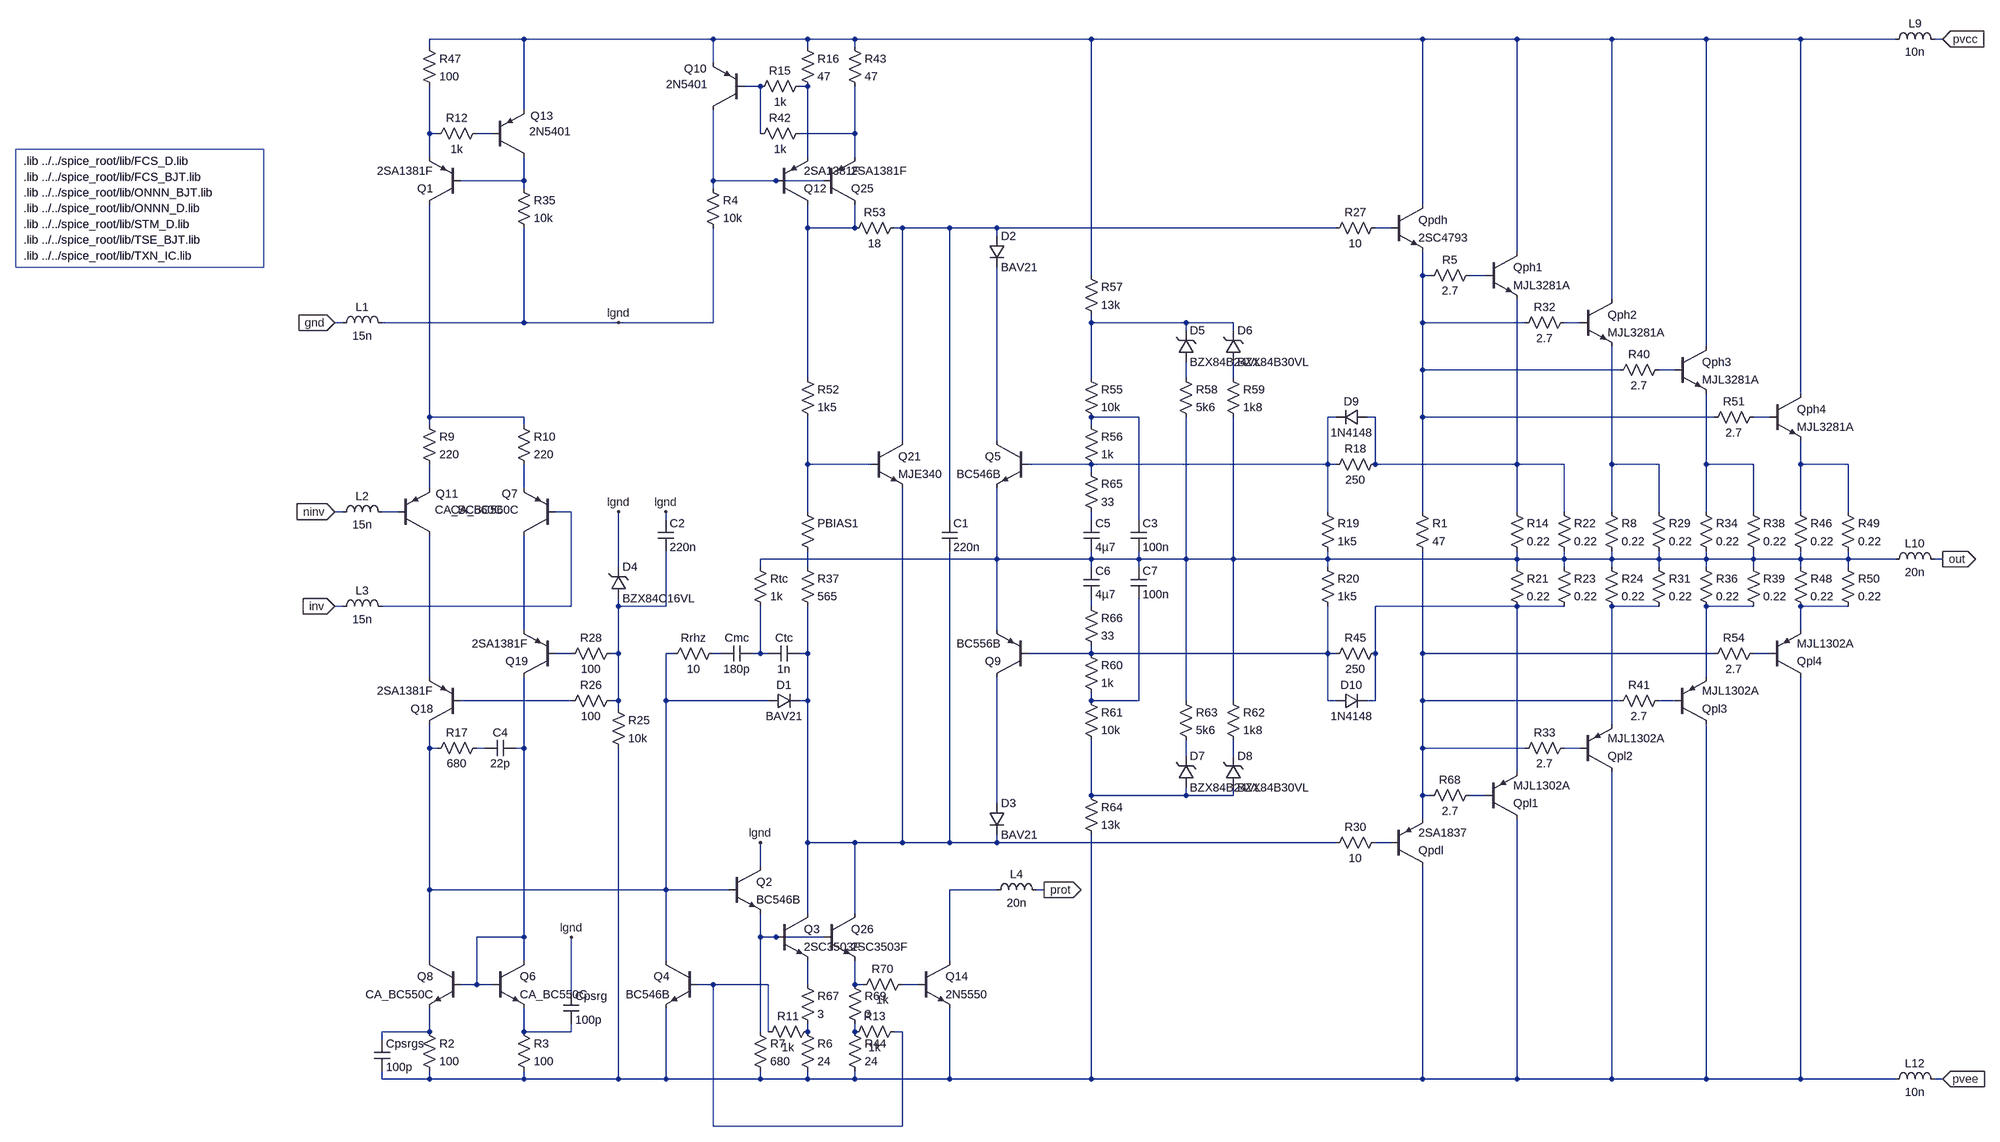
[diagram p0: schematic pab3bbb-arguo-module.asc]
pab3bbb-arguo-module.asc, the LTspice schematic file:
Version 4
SHEET 1 6124 2336
WIRE -192 -1280 -384 -1280
WIRE 192 -1280 -192 -1280
WIRE 384 -1280 192 -1280
WIRE 480 -1280 384 -1280
WIRE 960 -1280 480 -1280
WIRE 1632 -1280 960 -1280
WIRE 1824 -1280 1632 -1280
WIRE 2016 -1280 1824 -1280
WIRE 2208 -1280 2016 -1280
WIRE 2400 -1280 2208 -1280
WIRE 2592 -1280 2400 -1280
WIRE 2688 -1280 2672 -1280
WIRE -384 -1264 -384 -1280
WIRE 384 -1264 384 -1280
WIRE 480 -1264 480 -1280
WIRE 192 -1232 192 -1280
WIRE 288 -1184 256 -1184
WIRE 384 -1184 368 -1184
WIRE -192 -1136 -192 -1280
WIRE -384 -1088 -384 -1184
WIRE -368 -1088 -384 -1088
WIRE -256 -1088 -288 -1088
WIRE 288 -1088 288 -1184
WIRE 480 -1088 480 -1184
WIRE 480 -1088 368 -1088
WIRE -384 -1040 -384 -1088
WIRE 384 -1040 384 -1184
WIRE 480 -1040 480 -1088
WIRE -192 -992 -192 -1040
WIRE -192 -992 -320 -992
WIRE 192 -992 192 -1136
WIRE 320 -992 192 -992
WIRE 416 -992 320 -992
WIRE -192 -976 -192 -992
WIRE 192 -976 192 -992
WIRE 1632 -944 1632 -1280
WIRE 384 -896 384 -944
WIRE 480 -896 480 -944
WIRE 480 -896 384 -896
WIRE 576 -896 560 -896
WIRE 672 -896 576 -896
WIRE 768 -896 672 -896
WIRE 1456 -896 768 -896
WIRE 1568 -896 1536 -896
WIRE 768 -880 768 -896
WIRE 1824 -848 1824 -1280
WIRE 960 -800 960 -1280
WIRE 1632 -800 1632 -848
WIRE 1648 -800 1632 -800
WIRE 1760 -800 1728 -800
WIRE 2016 -752 2016 -1280
WIRE -560 -704 -576 -704
WIRE -192 -704 -192 -896
WIRE -192 -704 -480 -704
WIRE 0 -704 -192 -704
WIRE 192 -704 192 -896
WIRE 192 -704 0 -704
WIRE 960 -704 960 -720
WIRE 1152 -704 960 -704
WIRE 1248 -704 1152 -704
WIRE 1632 -704 1632 -800
WIRE 1840 -704 1632 -704
WIRE 1952 -704 1920 -704
WIRE 1152 -688 1152 -704
WIRE 1248 -688 1248 -704
WIRE 2208 -656 2208 -1280
WIRE 1632 -608 1632 -704
WIRE 2032 -608 1632 -608
WIRE 2144 -608 2112 -608
WIRE 384 -592 384 -896
WIRE 960 -592 960 -704
WIRE 1152 -592 1152 -624
WIRE 1248 -592 1248 -624
WIRE 2400 -560 2400 -1280
WIRE -384 -512 -384 -944
WIRE -192 -512 -384 -512
WIRE 1056 -512 960 -512
WIRE 1456 -512 1440 -512
WIRE 1536 -512 1520 -512
WIRE 1632 -512 1632 -608
WIRE 2224 -512 1632 -512
WIRE 2336 -512 2304 -512
WIRE -384 -496 -384 -512
WIRE -192 -496 -192 -512
WIRE 960 -496 960 -512
WIRE 576 -464 576 -896
WIRE 768 -464 768 -816
WIRE 384 -416 384 -512
WIRE 512 -416 384 -416
WIRE 960 -416 832 -416
WIRE 1440 -416 1440 -512
WIRE 1440 -416 960 -416
WIRE 1456 -416 1440 -416
WIRE 1536 -416 1536 -512
WIRE 1824 -416 1824 -752
WIRE 1824 -416 1536 -416
WIRE 1920 -416 1824 -416
WIRE 2016 -416 2016 -656
WIRE 2112 -416 2016 -416
WIRE 2208 -416 2208 -560
WIRE 2304 -416 2208 -416
WIRE 2400 -416 2400 -464
WIRE 2496 -416 2400 -416
WIRE 960 -400 960 -416
WIRE -384 -368 -384 -416
WIRE -192 -368 -192 -416
WIRE -560 -320 -576 -320
WIRE -448 -320 -480 -320
WIRE -96 -320 -128 -320
WIRE 384 -320 384 -416
WIRE 1440 -320 1440 -416
WIRE 1632 -320 1632 -512
WIRE 1824 -320 1824 -416
WIRE 1920 -320 1920 -416
WIRE 2016 -320 2016 -416
WIRE 2112 -320 2112 -416
WIRE 2208 -320 2208 -416
WIRE 2304 -320 2304 -416
WIRE 2400 -320 2400 -416
WIRE 2496 -320 2496 -416
WIRE 96 -304 96 -320
WIRE 672 -304 672 -896
WIRE 960 -304 960 -320
WIRE 1056 -304 1056 -512
WIRE 768 -224 768 -368
WIRE 768 -224 288 -224
WIRE 960 -224 960 -240
WIRE 960 -224 768 -224
WIRE 1056 -224 1056 -240
WIRE 1056 -224 960 -224
WIRE 1152 -224 1152 -512
WIRE 1152 -224 1056 -224
WIRE 1248 -224 1248 -512
WIRE 1248 -224 1152 -224
WIRE 1440 -224 1440 -240
WIRE 1440 -224 1248 -224
WIRE 1824 -224 1824 -240
WIRE 1824 -224 1440 -224
WIRE 1920 -224 1920 -240
WIRE 1920 -224 1824 -224
WIRE 2016 -224 2016 -240
WIRE 2016 -224 1920 -224
WIRE 2112 -224 2112 -240
WIRE 2112 -224 2016 -224
WIRE 2208 -224 2208 -240
WIRE 2208 -224 2112 -224
WIRE 2304 -224 2304 -240
WIRE 2304 -224 2208 -224
WIRE 2400 -224 2400 -240
WIRE 2400 -224 2304 -224
WIRE 2496 -224 2496 -240
WIRE 2496 -224 2400 -224
WIRE 2592 -224 2496 -224
WIRE 2688 -224 2672 -224
WIRE 0 -208 0 -320
WIRE 288 -208 288 -224
WIRE 384 -208 384 -240
WIRE 960 -208 960 -224
WIRE 1056 -208 1056 -224
WIRE 1440 -208 1440 -224
WIRE 1824 -208 1824 -224
WIRE 1920 -208 1920 -224
WIRE 2016 -208 2016 -224
WIRE 2112 -208 2112 -224
WIRE 2208 -208 2208 -224
WIRE 2304 -208 2304 -224
WIRE 2400 -208 2400 -224
WIRE 2496 -208 2496 -224
WIRE -560 -128 -576 -128
WIRE -96 -128 -96 -320
WIRE -96 -128 -480 -128
WIRE 0 -128 0 -144
WIRE 96 -128 96 -240
WIRE 96 -128 0 -128
WIRE 960 -128 960 -144
WIRE 1824 -128 1536 -128
WIRE 1920 -128 1824 -128
WIRE 2112 -128 2016 -128
WIRE 2304 -128 2208 -128
WIRE 2496 -128 2400 -128
WIRE -192 -80 -192 -272
WIRE 768 -80 768 -224
WIRE 2400 -80 2400 -128
WIRE -96 -32 -128 -32
WIRE 0 -32 0 -128
WIRE 0 -32 -16 -32
WIRE 112 -32 96 -32
WIRE 208 -32 192 -32
WIRE 288 -32 288 -128
WIRE 288 -32 272 -32
WIRE 304 -32 288 -32
WIRE 384 -32 384 -128
WIRE 384 -32 368 -32
WIRE 960 -32 960 -48
WIRE 960 -32 832 -32
WIRE 1440 -32 1440 -128
WIRE 1440 -32 960 -32
WIRE 1456 -32 1440 -32
WIRE 1536 -32 1536 -128
WIRE 1632 -32 1632 -240
WIRE 2224 -32 1632 -32
WIRE 2336 -32 2304 -32
WIRE -384 16 -384 -272
WIRE 2208 16 2208 -128
WIRE -96 64 -320 64
WIRE 0 64 0 -32
WIRE 0 64 -16 64
WIRE 96 64 96 -32
WIRE 304 64 96 64
WIRE 384 64 384 -32
WIRE 384 64 368 64
WIRE 960 64 960 48
WIRE 1056 64 1056 -144
WIRE 1056 64 960 64
WIRE 1152 64 1152 -224
WIRE 1248 64 1248 -224
WIRE 1440 64 1440 -32
WIRE 1456 64 1440 64
WIRE 1536 64 1536 -32
WIRE 1536 64 1520 64
WIRE 1632 64 1632 -32
WIRE 2032 64 1632 64
WIRE 2144 64 2112 64
WIRE 0 80 0 64
WIRE 2016 112 2016 -128
WIRE -384 160 -384 112
WIRE -368 160 -384 160
WIRE -272 160 -288 160
WIRE -192 160 -192 16
WIRE -192 160 -208 160
WIRE 1632 160 1632 64
WIRE 1840 160 1632 160
WIRE 1952 160 1920 160
WIRE 1152 176 1152 144
WIRE 1248 176 1248 144
WIRE 1824 208 1824 -128
WIRE 960 256 960 144
WIRE 1152 256 1152 240
WIRE 1152 256 960 256
WIRE 1248 256 1248 240
WIRE 1248 256 1152 256
WIRE 1632 256 1632 160
WIRE 1648 256 1632 256
WIRE 1760 256 1728 256
WIRE 768 272 768 16
WIRE 1632 304 1632 256
WIRE 384 352 384 64
WIRE 480 352 384 352
WIRE 576 352 576 -368
WIRE 576 352 480 352
WIRE 672 352 672 -240
WIRE 672 352 576 352
WIRE 768 352 768 336
WIRE 768 352 672 352
WIRE 1456 352 768 352
WIRE 1568 352 1536 352
WIRE 288 400 288 352
WIRE -384 448 -384 160
WIRE 96 448 96 64
WIRE 96 448 -384 448
WIRE 224 448 96 448
WIRE 768 448 672 448
WIRE 864 448 848 448
WIRE 384 496 384 352
WIRE 480 496 480 352
WIRE -192 544 -192 160
WIRE -192 544 -288 544
WIRE 288 544 288 496
WIRE 320 544 288 544
WIRE 416 544 320 544
WIRE -384 592 -384 448
WIRE -192 592 -192 544
WIRE 96 592 96 448
WIRE 672 592 672 448
WIRE -288 640 -288 544
WIRE -288 640 -320 640
WIRE -256 640 -288 640
WIRE 192 640 160 640
WIRE 304 640 192 640
WIRE 384 640 384 592
WIRE 480 640 480 592
WIRE 496 640 480 640
WIRE 608 640 576 640
WIRE -96 656 -96 544
WIRE -384 736 -384 688
WIRE -384 736 -480 736
WIRE -192 736 -192 688
WIRE -96 736 -96 720
WIRE -96 736 -192 736
WIRE 288 736 288 544
WIRE 304 736 304 640
WIRE 384 736 384 720
WIRE 480 736 480 720
WIRE 576 736 560 736
WIRE -480 752 -480 736
WIRE -480 832 -480 816
WIRE -384 832 -384 816
WIRE -384 832 -480 832
WIRE -192 832 -192 816
WIRE -192 832 -384 832
WIRE 0 832 0 160
WIRE 0 832 -192 832
WIRE 96 832 96 688
WIRE 96 832 0 832
WIRE 288 832 288 816
WIRE 288 832 96 832
WIRE 384 832 384 816
WIRE 384 832 288 832
WIRE 480 832 480 816
WIRE 480 832 384 832
WIRE 672 832 672 688
WIRE 672 832 480 832
WIRE 960 832 960 336
WIRE 960 832 672 832
WIRE 1632 832 1632 400
WIRE 1632 832 960 832
WIRE 1824 832 1824 304
WIRE 1824 832 1632 832
WIRE 2016 832 2016 208
WIRE 2016 832 1824 832
WIRE 2208 832 2208 112
WIRE 2208 832 2016 832
WIRE 2400 832 2400 16
WIRE 2400 832 2208 832
WIRE 2592 832 2400 832
WIRE 2688 832 2672 832
WIRE 192 928 192 640
WIRE 576 928 576 736
WIRE 576 928 192 928
FLAG 2688 -1280 pvcc
IOPIN 2688 -1280 In
FLAG 2688 832 pvee
IOPIN 2688 832 In
FLAG 2688 -224 out
IOPIN 2688 -224 Out
FLAG -576 -320 ninv
IOPIN -576 -320 In
FLAG -576 -128 inv
IOPIN -576 -128 In
FLAG -576 -704 gnd
IOPIN -576 -704 In
FLAG 0 -704 lgnd
FLAG 0 -320 lgnd
FLAG 96 -320 lgnd
FLAG 288 352 lgnd
FLAG -96 544 lgnd
FLAG 864 448 prot
IOPIN 864 448 Out
SYMBOL pnp -448 -272 M180
WINDOW 0 77 84 Left 2
WINDOW 3 75 52 Left 2
SYMATTR InstName Q11
SYMATTR Value CA_BC560C
SYMBOL res -400 720 R0
SYMATTR InstName R2
SYMATTR Value 100
SYMBOL res -208 720 R0
SYMATTR InstName R3
SYMATTR Value 100
SYMBOL res -400 -512 R0
SYMATTR InstName R9
SYMATTR Value 220
SYMBOL res -208 -512 R0
SYMATTR InstName R10
SYMATTR Value 220
SYMBOL res 368 -1280 R0
SYMATTR InstName R16
SYMATTR Value 47
SYMBOL pnp 320 -944 M180
SYMATTR InstName Q12
SYMATTR Value 2SA1381F
SYMBOL res 1552 -912 R90
WINDOW 0 0 56 VBottom 2
WINDOW 3 32 56 VTop 2
SYMATTR InstName R27
SYMATTR Value 10
SYMBOL res 1552 336 R90
WINDOW 0 0 56 VBottom 2
WINDOW 3 32 56 VTop 2
SYMATTR InstName R30
SYMATTR Value 10
SYMBOL res -400 -1280 R0
SYMATTR InstName R47
SYMATTR Value 100
SYMBOL res 368 -336 R0
WINDOW 3 36 76 Invisible 2
SYMATTR Value {1+(500*BIAS)}
SYMATTR InstName PBIAS1
SYMBOL res 368 -608 R0
SYMATTR InstName R52
SYMATTR Value 1k5
SYMBOL res 576 -912 R90
WINDOW 0 0 56 VBottom 2
WINDOW 3 32 56 VTop 2
SYMATTR InstName R53
SYMATTR Value 18
SYMBOL npn 320 496 R0
SYMATTR InstName Q3
SYMATTR Value 2SC3503F
SYMBOL res 368 720 R0
SYMATTR InstName R6
SYMATTR Value 24
SYMBOL res 176 -992 R0
SYMATTR InstName R4
SYMATTR Value 10k
SYMBOL pnp -320 -944 R180
SYMATTR InstName Q1
SYMATTR Value 2SA1381F
SYMBOL pnp -128 -272 R180
WINDOW 0 77 84 Left 2
WINDOW 3 75 52 Left 2
SYMATTR InstName Q7
SYMATTR Value CA_BC560C
SYMBOL npn 512 -464 R0
SYMATTR InstName Q21
SYMATTR Value MJE340
SYMBOL res 368 -224 R0
SYMATTR InstName R37
SYMATTR Value 565
SYMBOL npn 1760 -848 R0
SYMATTR InstName Qph1
SYMATTR Value MJL3281A
SYMBOL pnp 1760 304 M180
SYMATTR InstName Qpl1
SYMATTR Value MJL1302A
SYMBOL res 1744 -816 R90
WINDOW 0 0 56 VBottom 2
WINDOW 3 32 56 VTop 2
SYMATTR InstName R5
SYMATTR Value 2.7
SYMBOL res 1744 240 R90
WINDOW 0 0 56 VBottom 2
WINDOW 3 32 56 VTop 2
SYMATTR InstName R68
SYMATTR Value 2.7
SYMBOL cap 272 -48 R90
WINDOW 0 0 32 VBottom 2
WINDOW 3 32 32 VTop 2
SYMATTR InstName Cmc
SYMATTR Value 180p
SYMATTR SpiceLine V=100 Irms=20.8m Rser=5.448 Lser=3n Rpar=6.4meg Cpar=1p
SYMBOL npn -256 592 R0
SYMATTR InstName Q6
SYMATTR Value CA_BC550C
SYMBOL npn -320 592 M0
SYMATTR InstName Q8
SYMATTR Value CA_BC550C
SYMBOL res 384 -1200 R90
WINDOW 0 0 56 VBottom 2
WINDOW 3 32 56 VTop 2
SYMATTR InstName R15
SYMATTR Value 1k
SYMBOL npn 224 400 R0
SYMATTR InstName Q2
SYMATTR Value BC546B
SYMBOL res 272 720 R0
SYMATTR InstName R7
SYMATTR Value 680
SYMBOL cap 368 -48 R90
WINDOW 0 0 32 VBottom 2
WINDOW 3 32 32 VTop 2
SYMATTR InstName Ctc
SYMATTR Value 1n
SYMATTR SpiceLine V=100 Irms=75.3m Rser=2.89088 Lser=3n Rpar=4.4meg Cpar=1p
SYMBOL res 272 -224 R0
SYMATTR InstName Rtc
SYMATTR Value 1k
SYMBOL diode 304 80 R270
WINDOW 0 32 32 VTop 2
WINDOW 3 0 32 VBottom 2
SYMATTR InstName D1
SYMATTR Value BAV21
SYMBOL pnp 256 -1136 R180
WINDOW 0 77 84 Left 2
WINDOW 3 75 52 Left 2
SYMATTR InstName Q10
SYMATTR Value 2N5401
SYMBOL res 1808 -336 R0
SYMATTR InstName R14
SYMATTR Value 0.22
SYMBOL res 1808 -224 R0
SYMATTR InstName R21
SYMATTR Value 0.22
SYMBOL res -208 -992 R0
SYMATTR InstName R35
SYMATTR Value 10k
SYMBOL cap 656 -240 M180
WINDOW 0 24 56 Left 2
WINDOW 3 24 8 Left 2
SYMATTR InstName C1
SYMATTR Value 220n
SYMATTR SpiceLine V=25 Irms=1.76 Rser=0.057522 Lser=3n Rpar=4.4meg Cpar=1p
SYMBOL ind -576 -688 R270
WINDOW 0 32 56 VTop 2
WINDOW 3 5 56 VBottom 2
SYMATTR InstName L1
SYMATTR Value 15n
SYMATTR SpiceLine Rser=20m
SYMBOL ind -576 -304 R270
WINDOW 0 32 56 VTop 2
WINDOW 3 5 56 VBottom 2
SYMATTR InstName L2
SYMATTR Value 15n
SYMATTR SpiceLine Rser=20m
SYMBOL ind -576 -112 R270
WINDOW 0 32 56 VTop 2
WINDOW 3 5 56 VBottom 2
SYMATTR InstName L3
SYMATTR Value 15n
SYMATTR SpiceLine Rser=20m
SYMBOL ind 2576 -208 R270
WINDOW 0 32 56 VTop 2
WINDOW 3 5 56 VBottom 2
SYMATTR InstName L10
SYMATTR Value 20n
SYMATTR SpiceLine Rser=10m
SYMBOL ind 2576 -1264 R270
WINDOW 0 32 56 VTop 2
WINDOW 3 5 56 VBottom 2
SYMATTR InstName L9
SYMATTR Value 10n
SYMATTR SpiceLine Rser=10m
SYMBOL ind 2576 848 R270
WINDOW 0 32 56 VTop 2
WINDOW 3 5 56 VBottom 2
SYMATTR InstName L12
SYMATTR Value 10n
SYMATTR SpiceLine Rser=10m
SYMBOL cap -272 176 R270
WINDOW 0 32 32 VTop 2
WINDOW 3 0 32 VBottom 2
SYMATTR InstName C4
SYMATTR Value 22p
SYMATTR SpiceLine V=100 Irms=20.8m Rser=15.448 Lser=3n Rpar=6.4meg Cpar=1p
SYMBOL res -272 144 R90
WINDOW 0 0 56 VBottom 2
WINDOW 3 32 56 VTop 2
SYMATTR InstName R17
SYMATTR Value 680
SYMBOL pnp -256 -1040 M180
WINDOW 0 77 84 Left 2
WINDOW 3 75 52 Left 2
SYMATTR InstName Q13
SYMATTR Value 2N5401
SYMBOL res -272 -1104 R90
WINDOW 0 0 56 VBottom 2
WINDOW 3 32 56 VTop 2
SYMATTR InstName R12
SYMATTR Value 1k
SYMBOL npn 1568 -944 R0
SYMATTR InstName Qpdh
SYMATTR Value 2SC4793
SYMBOL pnp 1568 400 M180
SYMATTR InstName Qpdl
SYMATTR Value 2SA1837
SYMBOL res 1616 -336 R0
SYMATTR InstName R1
SYMATTR Value 47
SYMBOL cap -496 752 R0
SYMATTR InstName Cpsrgs
SYMATTR Value 100p
SYMATTR SpiceLine V=100 Irms=20.8m Rser=5.448 Lser=3n Rpar=6.4meg Cpar=1p
SYMBOL cap -112 656 R0
SYMATTR InstName Cpsrg
SYMATTR Value 100p
SYMATTR SpiceLine V=100 Irms=20.8m Rser=5.448 Lser=3n Rpar=6.4meg Cpar=1p
SYMBOL res 1904 -336 R0
SYMATTR InstName R22
SYMATTR Value 0.22
SYMBOL res 1904 -224 R0
SYMATTR InstName R23
SYMATTR Value 0.22
SYMBOL res 208 -48 R90
WINDOW 0 0 56 VBottom 2
WINDOW 3 32 56 VTop 2
SYMATTR InstName Rrhz
SYMATTR Value 10
SYMBOL zener -16 -144 M180
WINDOW 0 24 64 Left 2
WINDOW 3 24 0 Left 2
SYMATTR InstName D4
SYMATTR Value BZX84C16VL
SYMATTR Description Diode
SYMATTR Type diode
SYMBOL cap 80 -240 M180
WINDOW 0 24 56 Left 2
WINDOW 3 24 8 Left 2
SYMATTR InstName C2
SYMATTR Value 220n
SYMATTR SpiceLine V=25 Irms=1.76 Rser=0.057522 Lser=3n Rpar=4.4meg Cpar=1p
SYMBOL pnp -320 112 R180
SYMATTR InstName Q18
SYMATTR Value 2SA1381F
SYMBOL pnp -128 16 R180
SYMATTR InstName Q19
SYMATTR Value 2SA1381F
SYMBOL res -16 64 R0
SYMATTR InstName R25
SYMATTR Value 10k
SYMBOL res 0 48 R90
WINDOW 0 0 56 VBottom 2
WINDOW 3 32 56 VTop 2
SYMATTR InstName R26
SYMATTR Value 100
SYMBOL res 0 -48 R90
WINDOW 0 0 56 VBottom 2
WINDOW 3 32 56 VTop 2
SYMATTR InstName R28
SYMATTR Value 100
SYMBOL res 2000 -336 R0
SYMATTR InstName R8
SYMATTR Value 0.22
SYMBOL res 2000 -224 R0
SYMATTR InstName R24
SYMATTR Value 0.22
SYMBOL res 2096 -336 R0
SYMATTR InstName R29
SYMATTR Value 0.22
SYMBOL res 2096 -224 R0
SYMATTR InstName R31
SYMATTR Value 0.22
SYMBOL npn 1952 -752 R0
SYMATTR InstName Qph2
SYMATTR Value MJL3281A
SYMBOL res 1936 -720 R90
WINDOW 0 0 56 VBottom 2
WINDOW 3 32 56 VTop 2
SYMATTR InstName R32
SYMATTR Value 2.7
SYMBOL pnp 1952 208 M180
SYMATTR InstName Qpl2
SYMATTR Value MJL1302A
SYMBOL res 1936 144 R90
WINDOW 0 0 56 VBottom 2
WINDOW 3 32 56 VTop 2
SYMATTR InstName R33
SYMATTR Value 2.7
SYMBOL res 2192 -336 R0
SYMATTR InstName R34
SYMATTR Value 0.22
SYMBOL res 2192 -224 R0
SYMATTR InstName R36
SYMATTR Value 0.22
SYMBOL res 2288 -336 R0
SYMATTR InstName R38
SYMATTR Value 0.22
SYMBOL res 2288 -224 R0
SYMATTR InstName R39
SYMATTR Value 0.22
SYMBOL npn 2144 -656 R0
SYMATTR InstName Qph3
SYMATTR Value MJL3281A
SYMBOL res 2128 -624 R90
WINDOW 0 0 56 VBottom 2
WINDOW 3 32 56 VTop 2
SYMATTR InstName R40
SYMATTR Value 2.7
SYMBOL pnp 2144 112 M180
SYMATTR InstName Qpl3
SYMATTR Value MJL1302A
SYMBOL res 2128 48 R90
WINDOW 0 0 56 VBottom 2
WINDOW 3 32 56 VTop 2
SYMATTR InstName R41
SYMATTR Value 2.7
SYMBOL pnp 416 -944 M180
SYMATTR InstName Q25
SYMATTR Value 2SA1381F
SYMBOL res 384 -1104 R90
WINDOW 0 0 56 VBottom 2
WINDOW 3 32 56 VTop 2
SYMATTR InstName R42
SYMATTR Value 1k
SYMBOL res 464 -1280 R0
SYMATTR InstName R43
SYMATTR Value 47
SYMBOL npn 416 496 R0
SYMATTR InstName Q26
SYMATTR Value 2SC3503F
SYMBOL res 464 720 R0
SYMATTR InstName R44
SYMATTR Value 24
SYMBOL res 2384 -336 R0
SYMATTR InstName R46
SYMATTR Value 0.22
SYMBOL res 2384 -224 R0
SYMATTR InstName R48
SYMATTR Value 0.22
SYMBOL res 2480 -336 R0
SYMATTR InstName R49
SYMATTR Value 0.22
SYMBOL res 2480 -224 R0
SYMATTR InstName R50
SYMATTR Value 0.22
SYMBOL npn 2336 -560 R0
SYMATTR InstName Qph4
SYMATTR Value MJL3281A
SYMBOL res 2320 -528 R90
WINDOW 0 0 56 VBottom 2
WINDOW 3 32 56 VTop 2
SYMATTR InstName R51
SYMATTR Value 2.7
SYMBOL pnp 2336 16 M180
SYMATTR InstName Qpl4
SYMATTR Value MJL1302A
SYMBOL res 2320 -48 R90
WINDOW 0 0 56 VBottom 2
WINDOW 3 32 56 VTop 2
SYMATTR InstName R54
SYMATTR Value 2.7
SYMBOL ind 752 464 R270
WINDOW 0 32 56 VTop 2
WINDOW 3 5 56 VBottom 2
SYMATTR InstName L4
SYMATTR Value 20n
SYMATTR SpiceLine Rser=10m
SYMBOL npn 160 592 M0
SYMATTR InstName Q4
SYMATTR Value BC546B
SYMBOL res 400 720 R90
WINDOW 0 0 56 VBottom 2
WINDOW 3 32 56 VTop 2
SYMATTR InstName R11
SYMATTR Value 1k
SYMBOL res 576 720 R90
WINDOW 0 0 56 VBottom 2
WINDOW 3 32 56 VTop 2
SYMATTR InstName R13
SYMATTR Value 1k
SYMBOL npn 832 -464 M0
SYMATTR InstName Q5
SYMATTR Value BC546B
SYMBOL res 1552 -432 R90
WINDOW 0 0 56 VBottom 2
WINDOW 3 32 56 VTop 2
SYMATTR InstName R18
SYMATTR Value 250
SYMBOL res 1424 -336 R0
SYMATTR InstName R19
SYMATTR Value 1k5
SYMBOL diode 752 -880 R0
SYMATTR InstName D2
SYMATTR Value BAV21
SYMBOL pnp 832 16 R180
SYMATTR InstName Q9
SYMATTR Value BC556B
SYMBOL res 1424 -224 R0
SYMATTR InstName R20
SYMATTR Value 1k5
SYMBOL res 1552 -48 R90
WINDOW 0 0 56 VBottom 2
WINDOW 3 32 56 VTop 2
SYMATTR InstName R45
SYMATTR Value 250
SYMBOL diode 752 272 R0
SYMATTR InstName D3
SYMATTR Value BAV21
SYMBOL res 944 -608 R0
SYMATTR InstName R55
SYMATTR Value 10k
SYMBOL res 944 -512 R0
SYMATTR InstName R56
SYMATTR Value 1k
SYMBOL cap 1040 -304 R0
SYMATTR InstName C3
SYMATTR Value 100n
SYMBOL res 944 -816 R0
SYMATTR InstName R57
SYMATTR Value 13k
SYMBOL zener 1136 -624 M180
WINDOW 0 24 64 Left 2
WINDOW 3 24 0 Left 2
SYMATTR InstName D5
SYMATTR Value BZX84B24VL
SYMATTR Description Diode
SYMATTR Type diode
SYMBOL res 1136 -608 R0
SYMATTR InstName R58
SYMATTR Value 5k6
SYMBOL zener 1232 -624 M180
WINDOW 0 24 64 Left 2
WINDOW 3 24 0 Left 2
SYMATTR InstName D6
SYMATTR Value BZX84B30VL
SYMATTR Description Diode
SYMATTR Type diode
SYMBOL res 1232 -608 R0
SYMATTR InstName R59
SYMATTR Value 1k8
SYMBOL cap 944 -208 R0
SYMATTR InstName C6
SYMATTR Value 4µ7
SYMBOL cap 1040 -208 R0
SYMATTR InstName C7
SYMATTR Value 100n
SYMBOL res 944 -48 R0
SYMATTR InstName R60
SYMATTR Value 1k
SYMBOL res 944 48 R0
SYMATTR InstName R61
SYMATTR Value 10k
SYMBOL res 1232 48 R0
SYMATTR InstName R62
SYMATTR Value 1k8
SYMBOL res 1136 48 R0
SYMATTR InstName R63
SYMATTR Value 5k6
SYMBOL zener 1136 240 M180
WINDOW 0 24 64 Left 2
WINDOW 3 24 0 Left 2
SYMATTR InstName D7
SYMATTR Value BZX84B24VL
SYMATTR Description Diode
SYMATTR Type diode
SYMBOL zener 1232 240 M180
WINDOW 0 24 64 Left 2
WINDOW 3 24 0 Left 2
SYMATTR InstName D8
SYMATTR Value BZX84B30VL
SYMATTR Description Diode
SYMATTR Type diode
SYMBOL res 944 240 R0
SYMATTR InstName R64
SYMATTR Value 13k
SYMBOL cap 944 -304 R0
SYMATTR InstName C5
SYMATTR Value 4µ7
SYMBOL res 944 -416 R0
SYMATTR InstName R65
SYMATTR Value 33
SYMBOL res 944 -144 R0
SYMATTR InstName R66
SYMATTR Value 33
SYMBOL res 368 624 R0
SYMATTR InstName R67
SYMATTR Value 3
SYMBOL res 464 624 R0
SYMATTR InstName R69
SYMATTR Value 3
SYMBOL diode 1520 -528 R90
WINDOW 0 0 32 VBottom 2
WINDOW 3 32 32 VTop 2
SYMATTR InstName D9
SYMATTR Value 1N4148
SYMBOL diode 1456 80 R270
WINDOW 0 32 32 VTop 2
WINDOW 3 0 32 VBottom 2
SYMATTR InstName D10
SYMATTR Value 1N4148
SYMBOL npn 608 592 R0
SYMATTR InstName Q14
SYMATTR Value 2N5550
SYMBOL res 592 624 R90
WINDOW 0 0 56 VBottom 2
WINDOW 3 32 56 VTop 2
SYMATTR InstName R70
SYMATTR Value 1k
TEXT -1376 -968 Left 2 !.lib ../../spice_root/lib/ONNN_BJT.lib
TEXT -1376 -904 Left 2 !.lib ../../spice_root/lib/STM_D.lib
TEXT -1376 -1000 Left 2 !.lib ../../spice_root/lib/FCS_BJT.lib
TEXT -1376 -1032 Left 2 !.lib ../../spice_root/lib/FCS_D.lib
TEXT -1376 -936 Left 2 !.lib ../../spice_root/lib/ONNN_D.lib
TEXT -1376 -872 Left 2 !.lib ../../spice_root/lib/TSE_BJT.lib
TEXT -1376 -840 Left 2 !.lib ../../spice_root/lib/TXN_IC.lib
RECTANGLE Normal -720 -816 -1392 -1056

The netlist it stands for:
* pab3bbb-arguo-module.asc
Q11 N051 N031 N029 0 CA_BC560C
R2 N070 N074 100
R3 N071 N074 100
R9 N019 N029 220
R10 N019 N030 220
R16 N001 N003 47
Q12 N009 N008 N003 0 2SA1381F
R27 N011 N010 10
R30 N063 N047 10
R47 N001 N004 100
R§PBIAS1 N025 N035 {1+(500*BIAS)}
R52 N009 N025 1k5
R53 N010 N009 18
Q3 N047 N065 N067 0 2SC3503F
R6 N072 N074 24
R4 N008 lgnd 10k
Q1 N019 N007 N004 0 2SA1381F
Q7 N042 N032 N030 0 CA_BC560C
Q21 N010 N025 N047 0 MJE340
R37 N035 N047 565
Qph1 N001 N013 N022 0 MJL3281A
Qpl1 N074 N061 N038 0 MJL1302A
R5 N013 N012 2.7
R68 N061 N049 2.7
Cmc N046 N045 180p V=100 Irms=20.8m Rser=5.448 Lser=3n Rpar=6.4meg Cpar=1p
Q6 N056 N056 N071 0 CA_BC550C
Q8 N044 N056 N070 0 CA_BC550C
R15 N003 N002 1k
Q2 lgnd N044 N065 0 BC546B
R7 N065 N074 680
Ctc N047 N046 1n V=100 Irms=75.3m Rser=2.89088 Lser=3n Rpar=4.4meg Cpar=1p
Rtc N034 N046 1k
D1 N044 N047 BAV21
Q10 N008 N002 N001 0 2N5401
R14 N022 N034 0.22
R21 N034 N038 0.22
R35 N007 lgnd 10k
C1 N047 N010 220n V=25 Irms=1.76 Rser=0.057522 Lser=3n Rpar=4.4meg Cpar=1p
L1 gnd lgnd 15n Rser=20m
L2 ninv N031 15n Rser=20m
L3 inv N032 15n Rser=20m
L10 N034 out 20n Rser=10m
L9 N001 pvcc 10n Rser=10m
L12 N074 pvee 10n Rser=10m
C4 N055 N056 22p V=100 Irms=20.8m Rser=15.448 Lser=3n Rpar=6.4meg Cpar=1p
R17 N055 N044 680
Q13 N007 N005 N001 0 2N5401
R12 N005 N004 1k
Qpdh N001 N011 N012 0 2SC4793
Qpdl N074 N063 N049 0 2SA1837
R1 N012 N049 47
Cpsrgs N070 N074 100p V=100 Irms=20.8m Rser=5.448 Lser=3n Rpar=6.4meg Cpar=1p
Cpsrg lgnd N071 100p V=100 Irms=20.8m Rser=5.448 Lser=3n Rpar=6.4meg Cpar=1p
R22 N022 N034 0.22
R23 N034 N038 0.22
Rrhz N045 N044 10
D4 N036 lgnd BZX84C16VL
C2 N036 lgnd 220n V=25 Irms=1.76 Rser=0.057522 Lser=3n Rpar=4.4meg Cpar=1p
Q18 N044 N052 N051 0 2SA1381F
Q19 N056 N043 N042 0 2SA1381F
R25 N036 N074 10k
R26 N036 N052 100
R28 N036 N043 100
R8 N026 N034 0.22
R24 N034 N039 0.22
R29 N026 N034 0.22
R31 N034 N039 0.22
Qph2 N001 N015 N026 0 MJL3281A
R32 N015 N012 2.7
Qpl2 N074 N057 N039 0 MJL1302A
R33 N057 N049 2.7
R34 N027 N034 0.22
R36 N034 N040 0.22
R38 N027 N034 0.22
R39 N034 N040 0.22
Qph3 N001 N016 N027 0 MJL3281A
R40 N016 N012 2.7
Qpl3 N074 N054 N040 0 MJL1302A
R41 N054 N049 2.7
Q25 N009 N008 N006 0 2SA1381F
R42 N006 N002 1k
R43 N001 N006 47
Q26 N047 N065 N068 0 2SC3503F
R44 N073 N074 24
R46 N028 N034 0.22
R48 N034 N041 0.22
R49 N028 N034 0.22
R50 N034 N041 0.22
Qph4 N001 N023 N028 0 MJL3281A
R51 N023 N012 2.7
Qpl4 N074 N050 N041 0 MJL1302A
R54 N050 N049 2.7
L4 N064 prot 20n Rser=10m
Q4 N044 N066 N074 0 BC546B
R11 N072 N066 1k
R13 N066 N073 1k
Q5 N024 N021 N034 0 BC546B
R18 N022 N021 250
R19 N021 N034 1k5
D2 N010 N024 BAV21
Q9 N062 N048 N034 0 BC556B
R20 N034 N048 1k5
R45 N038 N048 250
D3 N062 N047 BAV21
R55 N014 N020 10k
R56 N020 N021 1k
C3 N020 N034 100n
R57 N001 N014 13k
D5 N017 N014 BZX84B24VL
R58 N017 N034 5k6
D6 N018 N014 BZX84B30VL
R59 N018 N034 1k8
C6 N034 N037 4µ7
C7 N034 N053 100n
R60 N048 N053 1k
R61 N053 N060 10k
R62 N034 N059 1k8
R63 N034 N058 5k6
D7 N060 N058 BZX84B24VL
D8 N060 N059 BZX84B30VL
R64 N060 N074 13k
C5 N033 N034 4µ7
R65 N021 N033 33
R66 N037 N048 33
R67 N067 N072 3
R69 N068 N073 3
D9 N022 N021 1N4148
D10 N048 N038 1N4148
Q14 N064 N069 N074 0 2N5550
R70 N069 N068 1k
.model D D
.lib standard.dio
.model NPN NPN
.model PNP PNP
.lib standard.bjt
.lib ../../spice_root/lib/ONNN_BJT.lib
.lib ../../spice_root/lib/STM_D.lib
.lib ../../spice_root/lib/FCS_BJT.lib
.lib ../../spice_root/lib/FCS_D.lib
.lib ../../spice_root/lib/ONNN_D.lib
.lib ../../spice_root/lib/TSE_BJT.lib
.lib ../../spice_root/lib/TXN_IC.lib
.backanno
.end